# Altium schematic sheet PCB OPTO FAST.SchDoc
size A
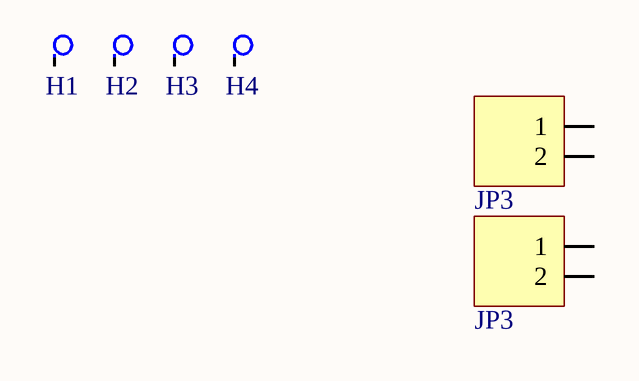
[diagram p0: PCB OPTO FAST.SchDoc]

## Parts
(Parts that share a designator on the sheet are numbered #1, #2 ... from top to bottom, then left to right.)
H1  Agujero de Montaje  [agujero]  (value not drawn)  (no BOM)
H2  Agujero de Montaje  [agujero]  (value not drawn)  (no BOM)
H3  Agujero de Montaje  [agujero]  (value not drawn)  (no BOM)
H4  Agujero de Montaje  [agujero]  (value not drawn)  (no BOM)
JP3#1  Header2x1  [CONPOL2X1]  (value not drawn)
JP3#2  Header2x1  [CONPOL2X1]  (value not drawn)

## Nets

Not connected (* = marked no-connect by the designer): H1 1; H2 1; H3 1; H4 1; JP3#1 1 2; JP3#2 1 2

## Library data of the parts
JP3#1 JP3#2 = Header2x1: Header 2x1; Price: ?